# Altium schematic sheet Alpha-1.SchDoc
size A3
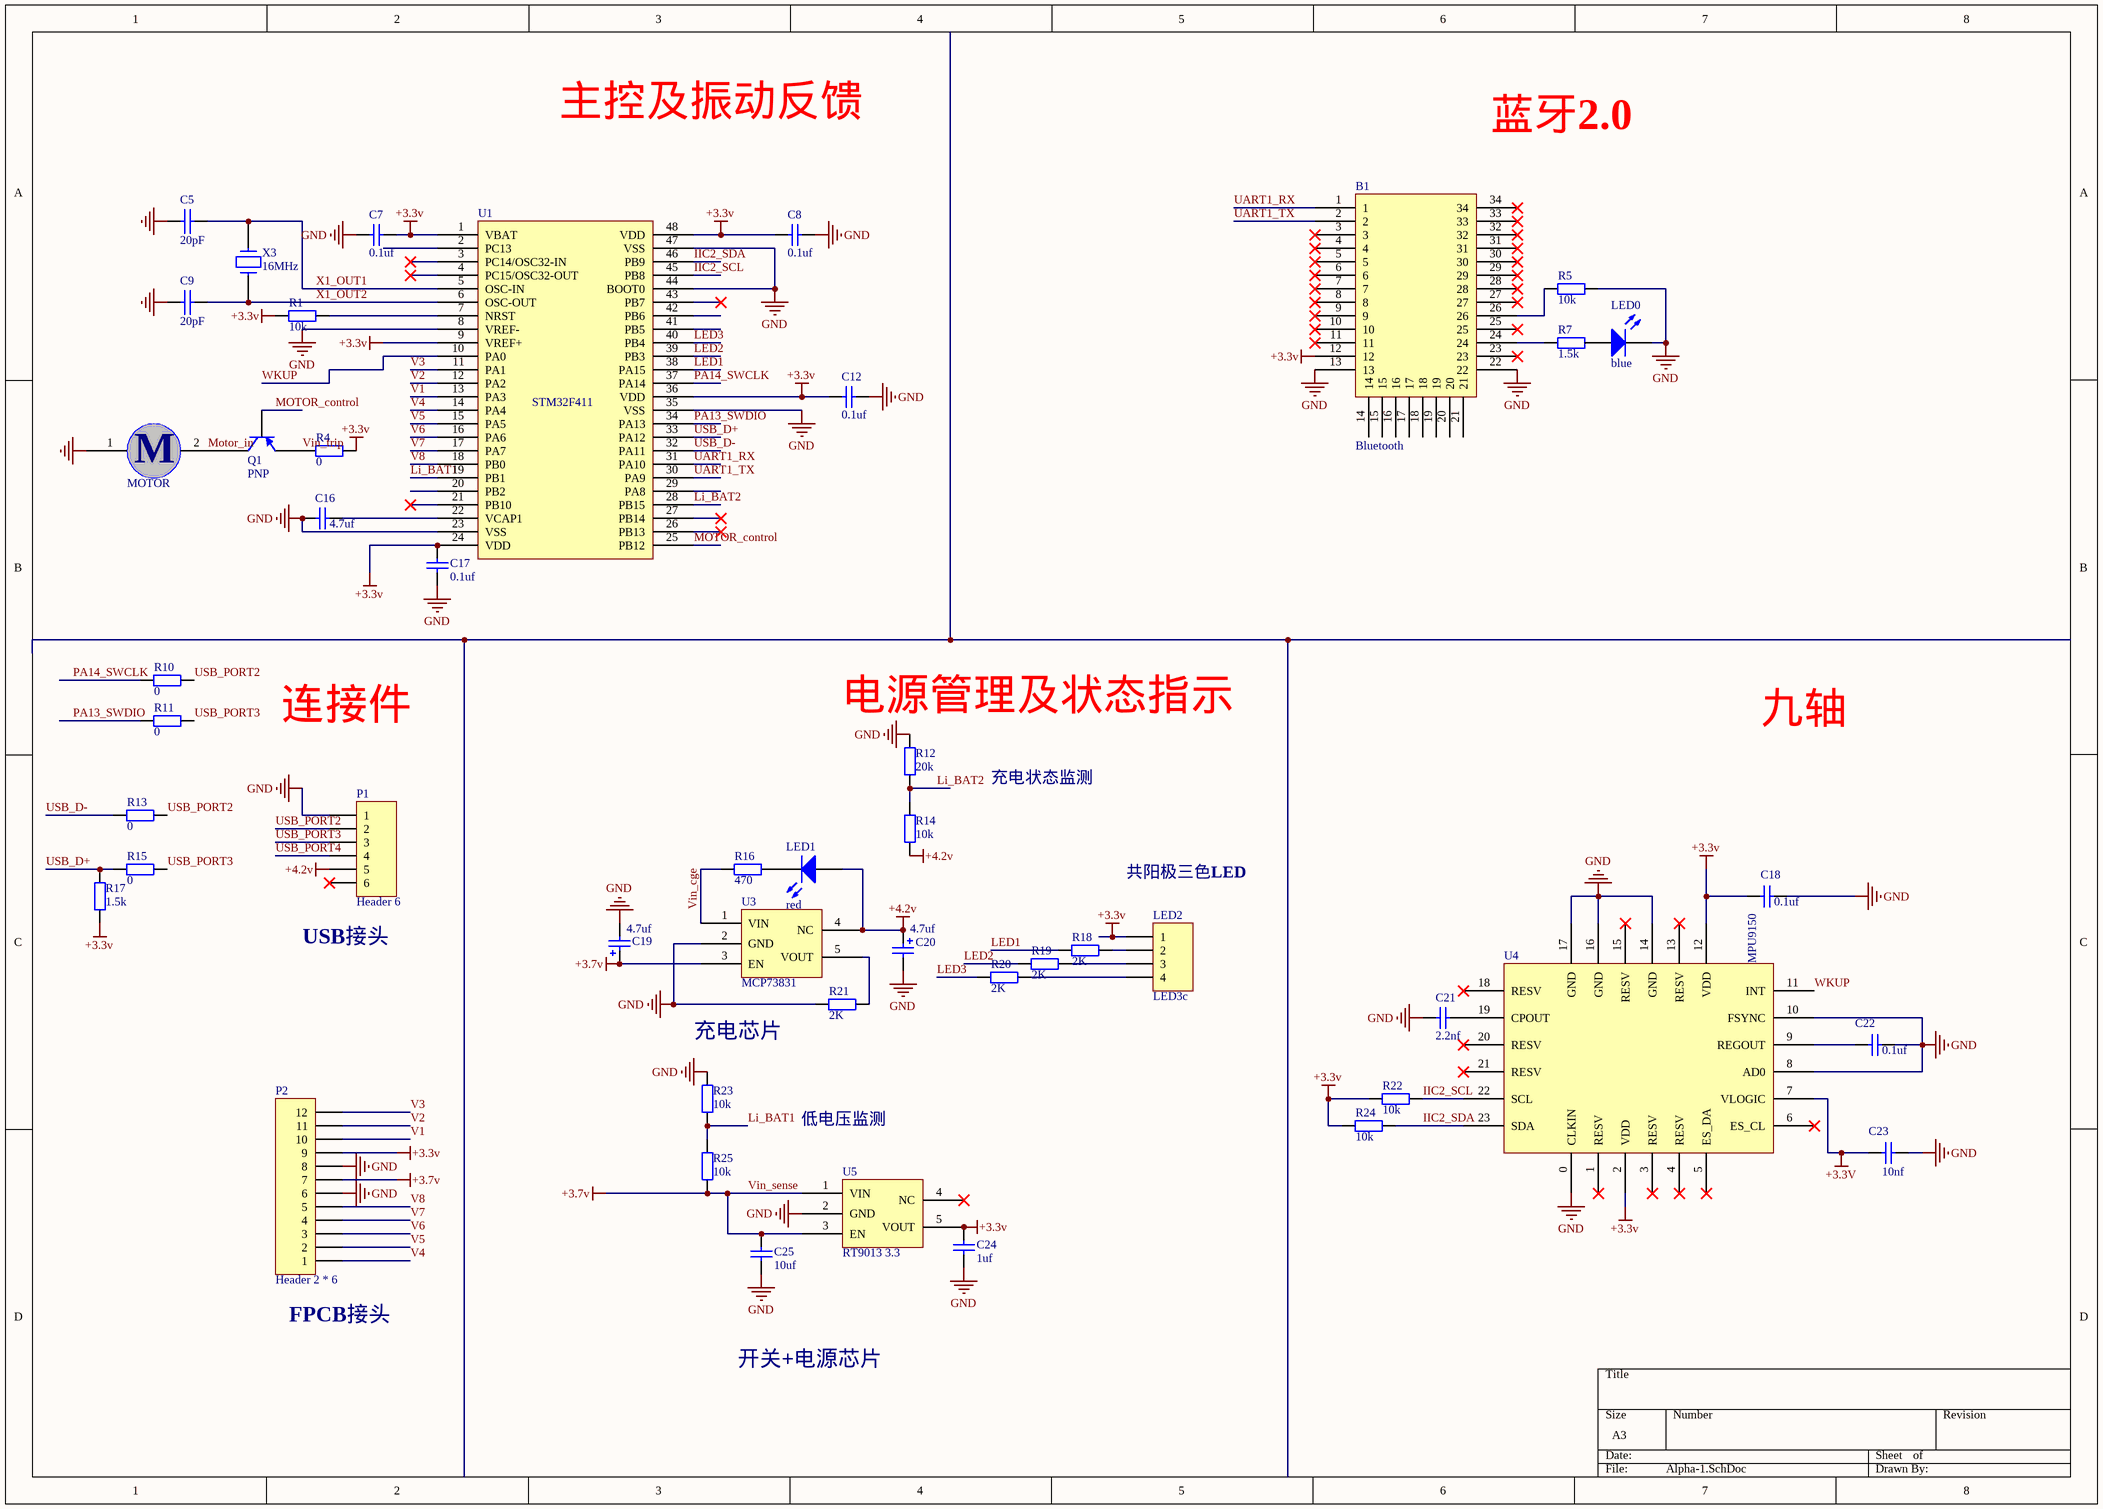
[diagram p0: Alpha-1.SchDoc]

## Parts
B1  Bluetooth  [Bluetooth]
C5  20pF  [0402]
C7  0.1uf  [0402]
C8  0.1uf  [0402]
C9  20pF  [0402]
C12  0.1uf  [0402]
C16  4.7uf  [0402]
C17  0.1uf  [0402]
C18  0.1uf  [0402]
C19  4.7uf  [0402]
C20  4.7uf  [0402]
C21  2.2nf  [0402]
C22  0.1uf  [0402]
C23  10nf  [0402]
C24  1uf  [0402]
C25  10uf  [0402]
LED0  blue  [0402]
LED1  red  [0402]
LED2  LED3c  [Quad4]
M1  MOTOR  [MOTOR]
P1  Header 6  [Micro USB]
P2  Header 2 * 6  [BTB0.5*2*6BOTTOM]
Q1  PNP  [SOT532]
R1  10k  [0402]
R4  0  [0402]
R5  10k  [0402]
R7  1.5k  [0402]
R10  0  [0402]
R11  0  [0402]
R12  20k  [0402]
R13  0  [0402]
R14  10k  [0402]
R15  0  [0402]
R16  470  [0402]
R17  1.5k  [0402]
R18  2K  [0402]
R19  2K  [0402]
R20  2K  [0402]
R21  2K  [0402]
R22  10k  [0402]
R23  10k  [0402]
R24  10k  [0402]
R25  10k  [0402]
U1  STM32F411  [STM32F411-UFQFPN48]  (value not drawn)
U3  MCP73831  [SOT23-5AM]
U4  MPU9150  [MPU9150]  (value not drawn)
U5  RT9013 3.3  [SC-70-5]
X3  16MHz  [16mhz]

## Nets
+3.3v: B1.12 C7.2 C8.2 C12.2 C17.2 C18.2 C23.2 C24.2 LED2.1 P2.9 R1.1 R4.2 R17.1 R22.2 R24.1 U1.1(VBAT) U1.9(VREF+) U1.24(VDD) U1.36(VDD) U1.48(VDD) U4.2(VDD) U4.7(VLOGIC) U4.12(VDD) U5.5(VOUT)
+4.2v: C20.1 LED1.1(A) P1.5 R14.1 U3.4(NC)
GND: B1.13 B1.22 C5.2 C7.1 C8.1 C9.2 C12.1 C16.1 C17.1 C18.1 C19.2 C20.2 C21.1 C22.1 C23.1 C24.1 C25.1 LED0.2(K) M1.1 P1.1 P2.6 P2.8 R5.2 R12.1 R21.1 R23.1 U1.8(VREF-) U1.23(VSS) U1.35(VSS) U1.44(BOOT0) U1.47(VSS) U3.2(GND) U4.0(CLKIN) U4.8(AD0) U4.10(FSYNC) U4.14(GND) U4.16(GND) U4.17(GND) U5.2(GND)
Vin_sense: C19.1 C25.2 P2.7 R25.1 U3.3(EN) U5.1(VIN) U5.3(EN)  [also labelled +3.7v]
IIC2_SCL: R22.1 U1.45(PB8) U4.22(SCL)
IIC2_SDA: R24.2 U1.46(PB9) U4.23(SDA)
LED1: R18.1 U1.38(PA15)
LED2: R19.1 U1.39(PB3)
LED3: R20.1 U1.40(PB4)
Li_BAT1: R23.2 R25.2 U1.19(PB1)
Li_BAT2: R12.2 R14.2 U1.28(PB15)
MOTOR_control: Q1.2(B) U1.25(PB12)
PA13_SWDIO: R11.1 U1.34(PA13)
PA14_SWCLK: R10.1 U1.37(PA14)
UART1_RX: B1.1 U1.31(PA10)
UART1_TX: B1.2 U1.30(PA9)
USB_D+: R15.1 R17.2 U1.33(PA12)
USB_D-: R13.1 U1.32(PA11)
USB_PORT2: P1.2 R10.2 R13.2
USB_PORT3: P1.3 R11.2 R15.2
USB_PORT4: P1.4
V1: P2.10 U1.13(PA3)
V2: P2.11 U1.12(PA2)
V3: P2.12 U1.11(PA1)
V4: P2.1 U1.14(PA4)
V5: P2.2 U1.15(PA5)
V6: P2.3 U1.16(PA6)
V7: P2.4 U1.17(PA7)
V8: P2.5 U1.18(PB0)
Vin_cge: R16.1 U3.1(VIN)
Vin_trip: Q1.3(E) R4.1
WKUP: U1.10(PA0) U4.11(INT)
X1_OUT1: C5.1 U1.5(OSC-IN) X3.2
X1_OUT2: C9.1 U1.6(OSC-OUT) X3.1
NetB1_24: B1.24 R7.1
NetB1_26: B1.26 R5.1
NetC16_2: C16.2 U1.22(VCAP1)
NetC21_2: C21.2 U4.19(CPOUT)
NetC22_2: C22.2 U4.9(REGOUT)
NetLED1_2: LED1.2(K) R16.2
NetLED2_2: LED2.2 R18.2
NetLED2_3: LED2.3 R19.2
NetLED2_4: LED2.4 R20.2
NetM1_2: M1.2 Q1.1(C)
NetR1_2: R1.2 U1.7(NRST)
NetR21_2: R21.2 U3.5(VOUT)

Not connected (* = marked no-connect by the designer): B1 3* 4* 5* 6* 7* 8* 9* 10* 11* 14 15 16 17 18 19 20 21 23* 25* 27* 28* 29* 30* 31* 32* 33* 34*; LED0 1(A); P1 6*; R7 2; U1 2(PC13) 3(PC14/OSC32-IN)* 4(PC15/OSC32-OUT)* 20(PB2) 21(PB10)* 26(PB13)* 27(PB14)* 29(PA8) 41(PB5) 42(PB6) 43(PB7)*; U4 1(RESV)* 3(RESV)* 4(RESV)* 5(ES_DA)* 6(ES_CL)* 13(RESV)* 15(RESV)* 18(RESV)* 20(RESV)* 21(RESV)*; U5 4(NC)*

## Notes on the sheet
- 主控及振动反馈
- 蓝牙2.0
- (near R12) 电源管理及状态指示
- 连接件
- 充电状态监测
- 九轴
- 共阳极三色LED
- (near P1) USB接头
- 充电芯片
- 低电压监测
- (near P2) FPCB接头
- 开关+电源芯片
- Labels drawn without touching a wire or pin: Motor_in
- (in symbol MOTOR) M

## Library data of the parts
C5 C9 = CAP: Capacitor
C7 C8 C12 C16-C18 C21-C25 = Cap: Capacitor; Published: 8-Jun-2000; LatestRevisionDate: 17-Jul-2002; LatestRevisionNote: Re-released for DXP Platform.; Publisher: Altium Limited
  C24: PackageReference: RAD-0.3; Value: 1uF
  C25: PackageReference: RAD-0.3; Value: 10uF
C19 C20 = Cap Pol1: Polarized Capacitor (Radial); Published: 8-Jun-2000; LatestRevisionDate: 17-Jul-2002; LatestRevisionNote: Re-released for DXP Platform.; Publisher: Altium Limited; Value: 4.7uf
LED0 LED1 = LED0: Typical INFRARED GaAs LED; Published: 8-Jun-2000; LatestRevisionDate: 17-Jul-2002; LatestRevisionNote: Re-released for DXP Platform.; Publisher: Altium Limited
LED2 = Header 4: Header, 4-Pin; LatestRevisionDate: 17-Jul-2002; LatestRevisionNote: Re-released for DXP Platform.; Publisher: Altium Limited
P1 = Header 6: Header, 6-Pin; LatestRevisionDate: 17-Jul-2002; LatestRevisionNote: Re-released for DXP Platform.; Publisher: Altium Limited
P2 = Header 12: Header, 12-Pin; LatestRevisionDate: 17-Jul-2002; LatestRevisionNote: Re-released for DXP Platform.; Publisher: Altium Limited
Q1 = PNP: PNP Bipolar Transistor; pin to pad: 1>3 2>1 3>2; Published: 8-Jun-2000; LatestRevisionDate: 29-May-2009; LatestRevisionNote: IPC-7351 Footprint Added.; PackageVersion: Aug-1999; PackageReference: SOT-23B; Publisher: Altium Limited; PackageDescription: 3-Pin SOT-23 Package 0.95 mm Pitch, 2.4 mm Lead Span
R1 R4 R16 = Res2: Resistor; Value: 470R; Published: 8-Jun-2000; LatestRevisionDate: 17-Jul-2002; LatestRevisionNote: Re-released for DXP Platform.; PackageReference: AXIAL-0.4; Publisher: Altium Limited
R5 R7 R14 R18-R25 = Res2: Resistor; Published: 8-Jun-2000; LatestRevisionDate: 17-Jul-2002; LatestRevisionNote: Re-released for DXP Platform.; PackageReference: AXIAL-0.4; Publisher: Altium Limited
  R5: Value: 10K
  R7: Value: 1.5K
  R14 R22-R25: Value: 10k
  R18-R21: Value: 2K
R10-R13 R15 R17 = Res2: Resistor; Value: 10k; Published: 8-Jun-2000; LatestRevisionDate: 17-Jul-2002; LatestRevisionNote: Re-released for DXP Platform.; PackageReference: AXIAL-0.4; Publisher: Altium Limited
U3 U5 = RT9013 SOT235
X3 = CRYSTAL: pin to pad: 2>3